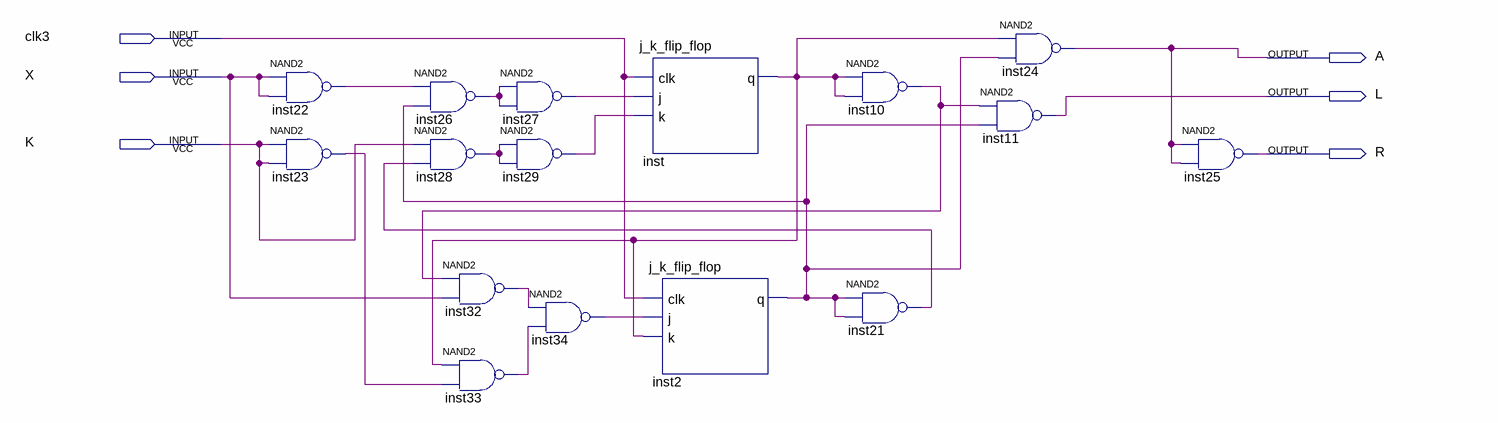
[diagram p0: schematic sheet]
// Quartus schematic uppgift3.bdf as structural Verilog: 16 symbols, 6 pins
module uppgift3 (
  input  clk3,
  input  X,
  input  K,
  output A,
  output L,
  output R
);

  wire inst2_q, inst10_out, inst21_out, inst22_out, inst23_out, inst26_out, inst27_out, inst28_out,
       inst29_out, inst32_out, inst33_out, inst34_out, inst_q;

  nand inst22 (inst22_out, X, X);
  nand inst23 (inst23_out, K, K);
  nand inst26 (inst26_out, inst22_out, inst2_q);
  nand inst28 (inst28_out, K, inst21_out);
  nand inst32 (inst32_out, inst10_out, X);
  nand inst33 (inst33_out, inst_q, inst23_out);
  nand inst27 (inst27_out, inst26_out, inst26_out);
  nand inst29 (inst29_out, inst28_out, inst28_out);
  nand inst34 (inst34_out, inst32_out, inst33_out);
  j_k_flip_flop inst (.clk(clk3), .j(inst27_out), .k(inst29_out), .q(inst_q));
  j_k_flip_flop inst2 (.clk(clk3), .j(inst34_out), .k(inst_q), .q(inst2_q));
  nand inst10 (inst10_out, inst_q, inst_q);
  nand inst21 (inst21_out, inst2_q, inst2_q);
  nand inst24 (A, inst_q, inst2_q);
  nand inst11 (L, inst10_out, inst2_q);
  nand inst25 (R, A, A);
endmodule
